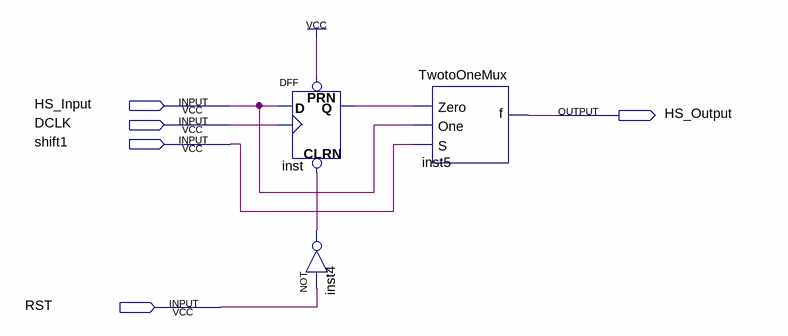
[diagram p0: schematic sheet]
// Quartus schematic HolderShifterModule.bdf as structural Verilog: 3 symbols, 5 pins
module HolderShifterModule (
  input  HS_Input,
  input  DCLK,
  input  shift1,
  input  RST,
  output HS_Output
);

  wire inst4_out, inst_q;

  DFF inst (.CLRN(inst4_out), .CLK(DCLK), .D(HS_Input), .PRN(1'b1), .Q(inst_q));
  not inst4 (inst4_out, RST);
  TwotoOneMux inst5 (.Zero(inst_q), .S(shift1), .One(HS_Input), .f(HS_Output));
endmodule
